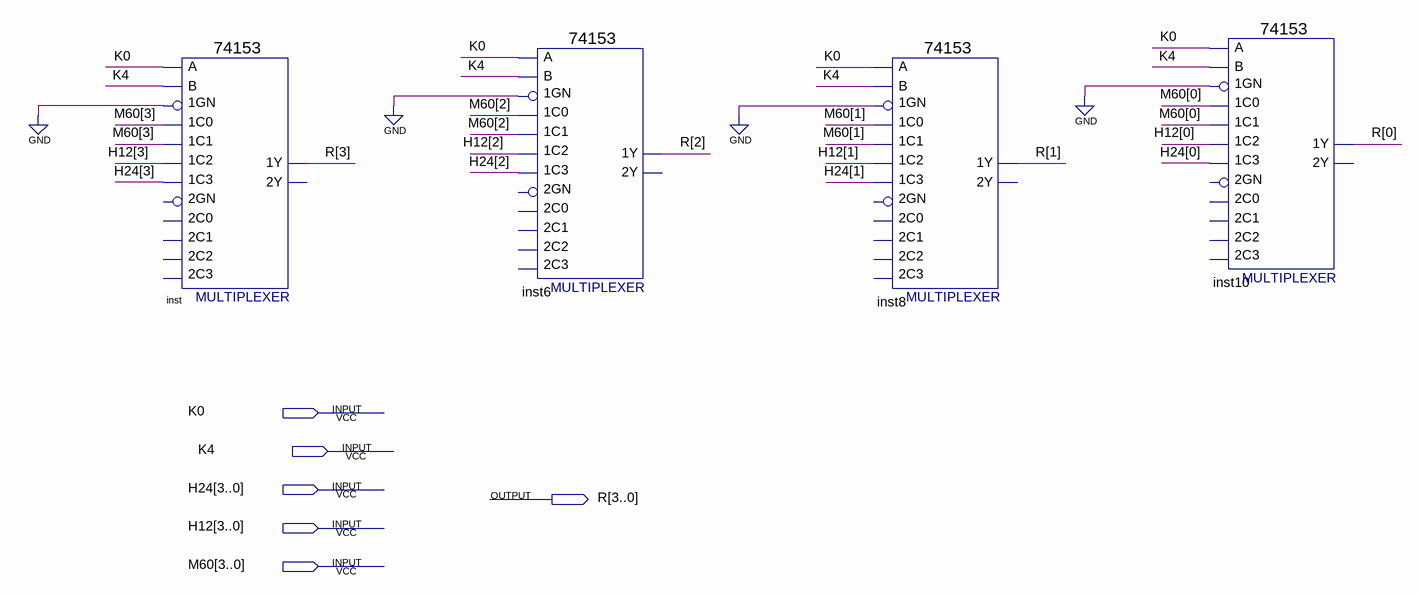
[diagram p0: schematic sheet]
// Quartus schematic 3c1.bdf as structural Verilog: 4 symbols, 6 pins
module \3c1  (
  input  K0,
  input  K4,
  input  [3:0] H24,
  input  [3:0] H12,
  input  [3:0] M60,
  output [3:0] R
);

  \74153  inst (
    .\1C1 (M60[3]), .\1GN (1'b0), .\1C0 (M60[3]), .\1C2 (H12[3]), .\1C3 (H24[3]), .B(K4), .A(K0), .\1Y (R[3]));  // open: 2C0, 2GN, 2C2, 2C1, 2C3, 2Y
  \74153  inst6 (
    .\1C1 (M60[2]), .\1GN (1'b0), .\1C0 (M60[2]), .\1C2 (H12[2]), .\1C3 (H24[2]), .B(K4), .A(K0), .\1Y (R[2]));  // open: 2C0, 2GN, 2C2, 2C1, 2C3, 2Y
  \74153  inst8 (
    .\1C1 (M60[1]), .\1GN (1'b0), .\1C0 (M60[1]), .\1C2 (H12[1]), .\1C3 (H24[1]), .B(K4), .A(K0), .\1Y (R[1]));  // open: 2C0, 2GN, 2C2, 2C1, 2C3, 2Y
  \74153  inst10 (
    .\1C1 (M60[0]), .\1GN (1'b0), .\1C0 (M60[0]), .\1C2 (H12[0]), .\1C3 (H24[0]), .B(K4), .A(K0), .\1Y (R[0]));  // open: 2C0, 2GN, 2C2, 2C1, 2C3, 2Y
endmodule
